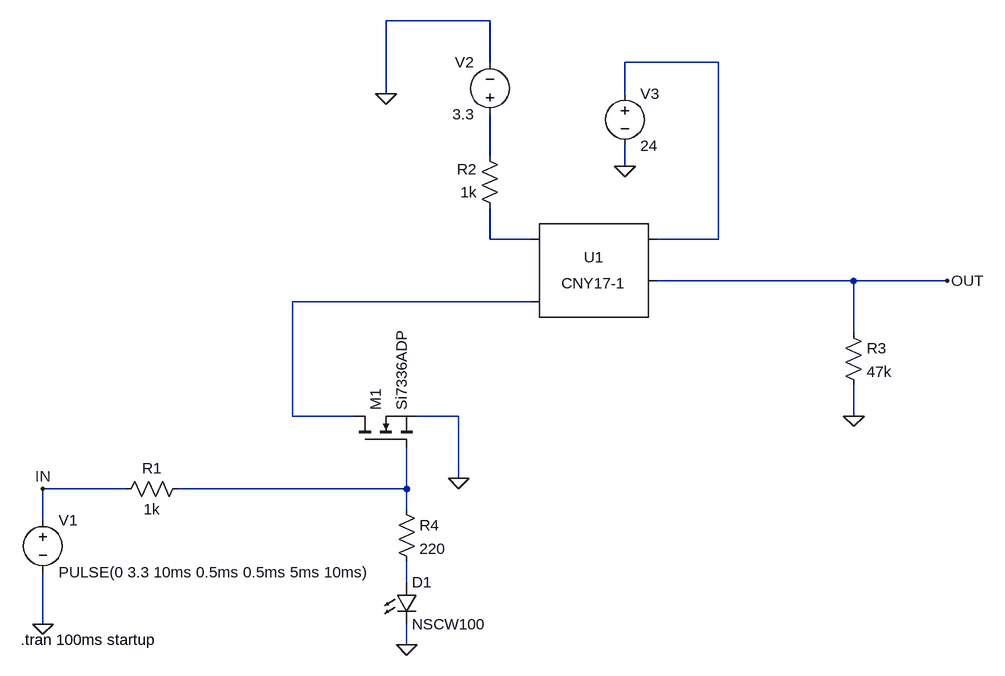
[diagram p0: schematic digital_output.asc]
digital_output.asc, the LTspice schematic file:
Version 4
SHEET 1 1380 680
WIRE 608 -544 448 -544
WIRE 608 -480 608 -544
WIRE 960 -480 816 -480
WIRE 448 -432 448 -544
WIRE 816 -432 816 -480
WIRE 608 -336 608 -400
WIRE 816 -320 816 -352
WIRE 608 -208 608 -256
WIRE 672 -208 608 -208
WIRE 960 -208 960 -480
WIRE 960 -208 864 -208
WIRE 1168 -144 864 -144
WIRE 1312 -144 1168 -144
WIRE 672 -112 304 -112
WIRE 1168 -64 1168 -144
WIRE 304 64 304 -112
WIRE 400 64 304 64
WIRE 560 64 496 64
WIRE 1168 64 1168 16
WIRE 560 160 560 64
WIRE 48 176 -80 176
WIRE 480 176 480 112
WIRE 480 176 128 176
WIRE 480 208 480 176
WIRE -80 224 -80 176
WIRE 480 320 480 288
WIRE -80 384 -80 304
WIRE -80 384 -96 384
WIRE 480 416 480 384
FLAG -80 384 0
FLAG 560 160 0
FLAG 816 -320 0
FLAG 1312 -144 OUT
FLAG -80 176 IN
FLAG 448 -432 0
FLAG 1168 64 0
FLAG 480 416 0
SYMBOL voltage -80 208 R0
WINDOW 123 0 0 Left 0
WINDOW 39 0 0 Left 0
SYMATTR InstName V1
SYMATTR Value PULSE(0 3.3 10ms 0.5ms 0.5ms 5ms 10ms)
SYMBOL res 144 160 R90
WINDOW 0 0 56 VBottom 2
WINDOW 3 32 56 VTop 2
SYMATTR InstName R1
SYMATTR Value 1k
SYMBOL nmos 400 112 R270
SYMATTR InstName M1
SYMATTR Value Si7336ADP
SYMBOL Optos\\CNY17-1 768 -144 R0
SYMATTR InstName U1
SYMBOL res 624 -240 R180
WINDOW 0 36 76 Left 2
WINDOW 3 36 40 Left 2
SYMATTR InstName R2
SYMATTR Value 1k
SYMBOL voltage 816 -448 R0
WINDOW 123 0 0 Left 0
WINDOW 39 0 0 Left 0
SYMATTR InstName V3
SYMATTR Value 24
SYMBOL res 1152 -80 R0
SYMATTR InstName R3
SYMATTR Value 47k
SYMBOL voltage 608 -384 R180
WINDOW 0 24 96 Left 2
WINDOW 3 24 16 Left 2
WINDOW 123 0 0 Left 0
WINDOW 39 0 0 Left 0
SYMATTR InstName V2
SYMATTR Value 3.3
SYMBOL res 464 192 R0
SYMATTR InstName R4
SYMATTR Value 220
SYMBOL LED 464 320 R0
SYMATTR InstName D1
SYMATTR Value NSCW100
TEXT -114 408 Left 2 !.tran 100ms startup

The netlist it stands for:
* digital_output.asc
V1 IN 0 PULSE(0 3.3 10ms 0.5ms 0.5ms 5ms 10ms)
R1 N005 IN 1k
M1 N004 N005 0 0 Si7336ADP
XU1 N003 N004 N001 OUT NC_01 CNY17 Igain=.724m
R2 N003 N002 1k
V3 N001 0 24
R3 OUT 0 47k
V2 N002 0 3.3
R4 N005 N006 220
D1 N006 0 NSCW100
.model D D
.lib standard.dio
.model NMOS NMOS
.model PMOS PMOS
.lib standard.mos
.tran 100ms startup
.lib CNY17.sub
.backanno
.end

* Results of the author's LTspice run, read from the files saved beside the schematic
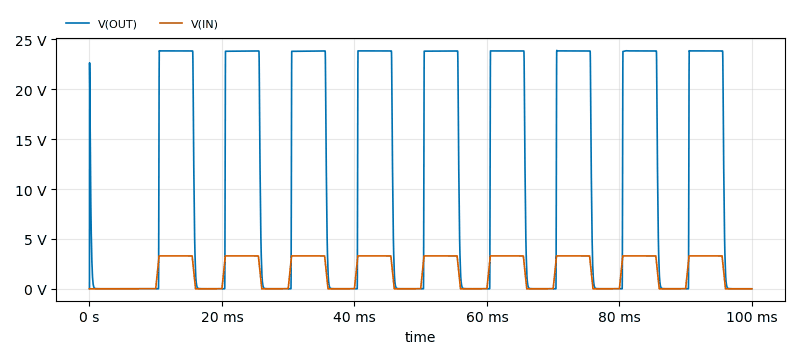
[diagram p1: Transient Analysis of digital_output.asc, plotted from the saved traces]
* Transient Analysis, 1 run:
*   V(OUT): min 0 V, max 23.91 V, average 11.43 V, rms 16.36 V, last 421.9 µV
*   V(IN): min 0 V, max 3.3 V, average 1.633 V, rms 2.287 V, last 0 V